# Altium schematic sheet RSSI.SchDoc
size A4
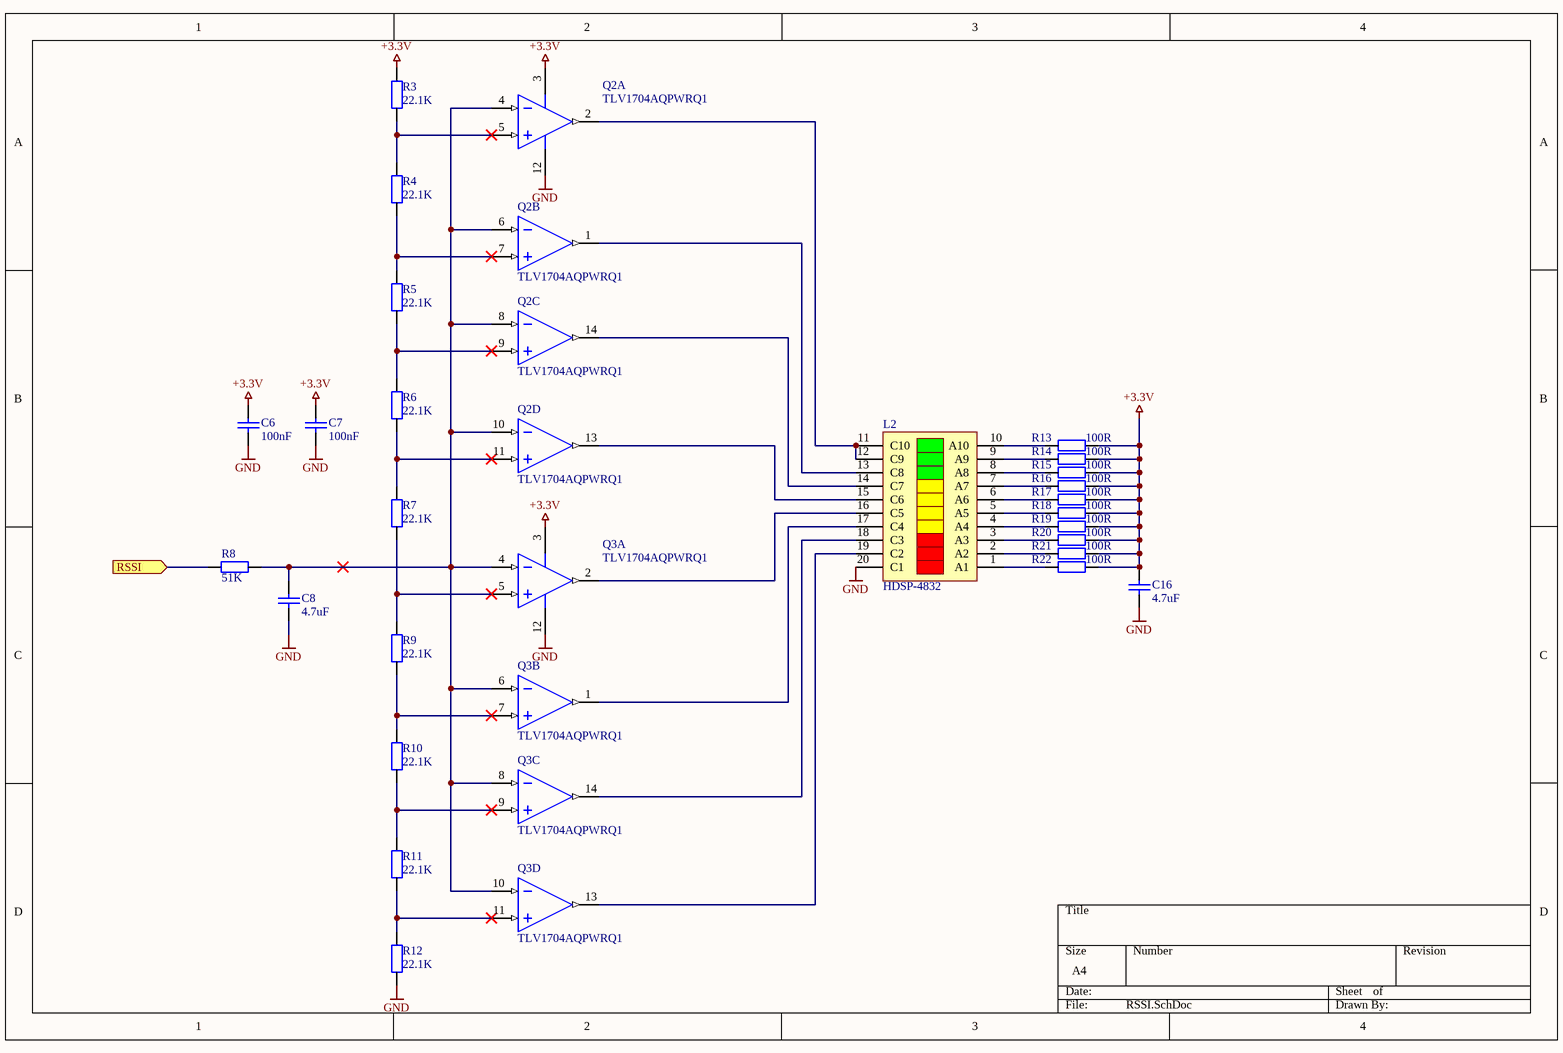
[diagram p0: RSSI.SchDoc]

## Parts
C6  value 100nF  [CAPC1608X08N]  (hidden comment: CGA3E2X7R1H104K080AA)
C7  value 100nF  [CAPC1608X08N]  (hidden comment: CGA3E2X7R1H104K080AA)
C8  value 4.7uF  [CAPC2012X14N]  (hidden comment: CGA4J3X5R1H475K125AB)
C16  value 4.7uF  [CAPC2012X14N]  (hidden comment: CGA4J3X5R1H475K125AB)
L2  HDSP-4832  [HDSP-4832]
Q2  TLV1704AQPWRQ1  [TSOP65P640X120-14N]  (parts A,B,C,D of 4)
Q3  TLV1704AQPWRQ1  [TSOP65P640X120-14N]  (parts A,B,C,D of 4)
R3  value 22.1K  [RESC1608X04N]  (hidden comment: ERJ-3EKF2212V)
R4  value 22.1K  [RESC1608X04N]  (hidden comment: ERJ-3EKF2212V)
R5  value 22.1K  [RESC1608X04N]  (hidden comment: ERJ-3EKF2212V)
R6  value 22.1K  [RESC1608X04N]  (hidden comment: ERJ-3EKF2212V)
R7  value 22.1K  [RESC1608X04N]  (hidden comment: ERJ-3EKF2212V)
R8  value 51K  [RESC1608X04N]  (hidden comment: ERJ-3EKF5102V)
R9  value 22.1K  [RESC1608X04N]  (hidden comment: ERJ-3EKF2212V)
R10  value 22.1K  [RESC1608X04N]  (hidden comment: ERJ-3EKF2212V)
R11  value 22.1K  [RESC1608X04N]  (hidden comment: ERJ-3EKF2212V)
R12  value 22.1K  [RESC1608X04N]  (hidden comment: ERJ-3EKF2212V)
R13  value 100R  [RESC1608X04N]  (hidden comment: ERJ-3EKF1000V)
R14  value 100R  [RESC1608X04N]  (hidden comment: ERJ-3EKF1000V)
R15  value 100R  [RESC1608X04N]  (hidden comment: ERJ-3EKF1000V)
R16  value 100R  [RESC1608X04N]  (hidden comment: ERJ-3EKF1000V)
R17  value 100R  [RESC1608X04N]  (hidden comment: ERJ-3EKF1000V)
R18  value 100R  [RESC1608X04N]  (hidden comment: ERJ-3EKF1000V)
R19  value 100R  [RESC1608X04N]  (hidden comment: ERJ-3EKF1000V)
R20  value 100R  [RESC1608X04N]  (hidden comment: ERJ-3EKF1000V)
R21  value 100R  [RESC1608X04N]  (hidden comment: ERJ-3EKF1000V)
R22  value 100R  [RESC1608X04N]  (hidden comment: ERJ-3EKF1000V)

## Ports
RSSI (in)

## Nets
+3.3V: C6.2 C7.2 C16.2 Q2.3(V+) Q3.3(V+) R3.2 R13.2 R14.2 R15.2 R16.2 R17.2 R18.2 R19.2 R20.2 R21.2 R22.2
GND: C6.1 C7.1 C8.1 C16.1 L2.20(C1) Q2.12(V-) Q3.12(V-) R12.1
RSSI: R8.2 ; port RSSI
NetC8_2: C8.2 Q2.4(IN1-) Q2.6(IN2-) Q2.8(IN3-) Q2.10(IN4-) Q3.4(IN1-) Q3.6(IN2-) Q3.8(IN3-) Q3.10(IN4-) R8.1
NetL2_1: L2.1(A1) R22.1
NetL2_2: L2.2(A2) R21.1
NetL2_3: L2.3(A3) R20.1
NetL2_4: L2.4(A4) R19.1
NetL2_5: L2.5(A5) R18.1
NetL2_6: L2.6(A6) R17.1
NetL2_7: L2.7(A7) R16.1
NetL2_8: L2.8(A8) R15.1
NetL2_9: L2.9(A9) R14.1
NetL2_10: L2.10(A10) R13.1
NetL2_11: L2.11(C10) L2.12(C9) Q2.2(OUT1)
NetL2_13: L2.13(C8) Q2.1(OUT2)
NetL2_14: L2.14(C7) Q2.14(OUT3)
NetL2_15: L2.15(C6) Q2.13(OUT4)
NetL2_16: L2.16(C5) Q3.2(OUT1)
NetL2_17: L2.17(C4) Q3.1(OUT2)
NetL2_18: L2.18(C3) Q3.14(OUT3)
NetL2_19: L2.19(C2) Q3.13(OUT4)
NetQ2_5: Q2.5(IN1+) R3.1 R4.2
NetQ2_7: Q2.7(IN2+) R4.1 R5.2
NetQ2_9: Q2.9(IN3+) R5.1 R6.2
NetQ2_11: Q2.11(IN4+) R6.1 R7.2
NetQ3_5: Q3.5(IN1+) R7.1 R9.2
NetQ3_7: Q3.7(IN2+) R9.1 R10.2
NetQ3_9: Q3.9(IN3+) R10.1 R11.2
NetQ3_11: Q3.11(IN4+) R11.1 R12.2

## Library data of the parts
C6 C7 = C0603-100nF-50V: 0603 Capacitor, 100nF; Supplier 1: Mouser; Supplier Part Number 1: 810-CGA3E2X7R1H104K
C8 C16 = C0805-4.7uF-50V: 0805 Capacitor, 4.7uF; Supplier 1: Mouser; Supplier Part Number 1: 810-CGA4J3X5R1H475K
L2 = HDSP-4832: 10-Element Bar Graph Array, Red Yellow Green; Supplier 1: Mouser; Supplier Part Number 1: 630-HDSP-4832
Q2 Q3 = TLV1704Q: TLV1704-Q1 2.2-V to 36-V, microPower Comparator, 4 channels; Published: 8-Jun-2000; LatestRevisionDate: 17-Jul-2002; LatestRevisionNote: Re-released for DXP Platform.; DatasheetVersion: REV. B; PackageVersion: 1990; PackageReference: H-08A; Publisher: Altium Limited; PackageDescription: Can; 8 Leads; Pin Circle Dia. 5.08 mm; Lead Dia. 0.53 mm (max); ComponentLink1Description: Manufacturer Link; ComponentLink1URL: http://www.analog.com/; Supplier 1: Mouser; Supplier Part Number 1: 595-TLV1704AQPWRQ1
R3-R7 R9-R12 = R0603R22.1K: 0603 Resistor; Supplier 1: Mouser; Supplier Part Number 1: 667-ERJ-3EKF2212V
R8 = R0603R51K: 0603 Resistor; Supplier 1: Mouser; Supplier Part Number 1: 667-ERJ-3EKF5102V
R13-R22 = R0603R100: 0603 Resistor; Supplier 1: Mouser; Supplier Part Number 1: 667-ERJ-3EKF1000V